# Altium schematic sheet BLETemp.SchDoc
size A4; PageSetup: Record=PageOptions|CenterHorizontal=True|CenterVertical=True|PrintScale=0.95|XCorrection=1.00|YCorrection=1.00|PrintKind=1|BorderSize=5000000|LeftOffset=0|BottomOffset=0|Orientation=2|PaperLength=1000|PaperWidth=1000|Scale=100|PaperSource=257|PrintQuality=600|MediaType=1|DitherType=10|PrintScaleMode=1|PaperKind=A4|PaperIndex=9
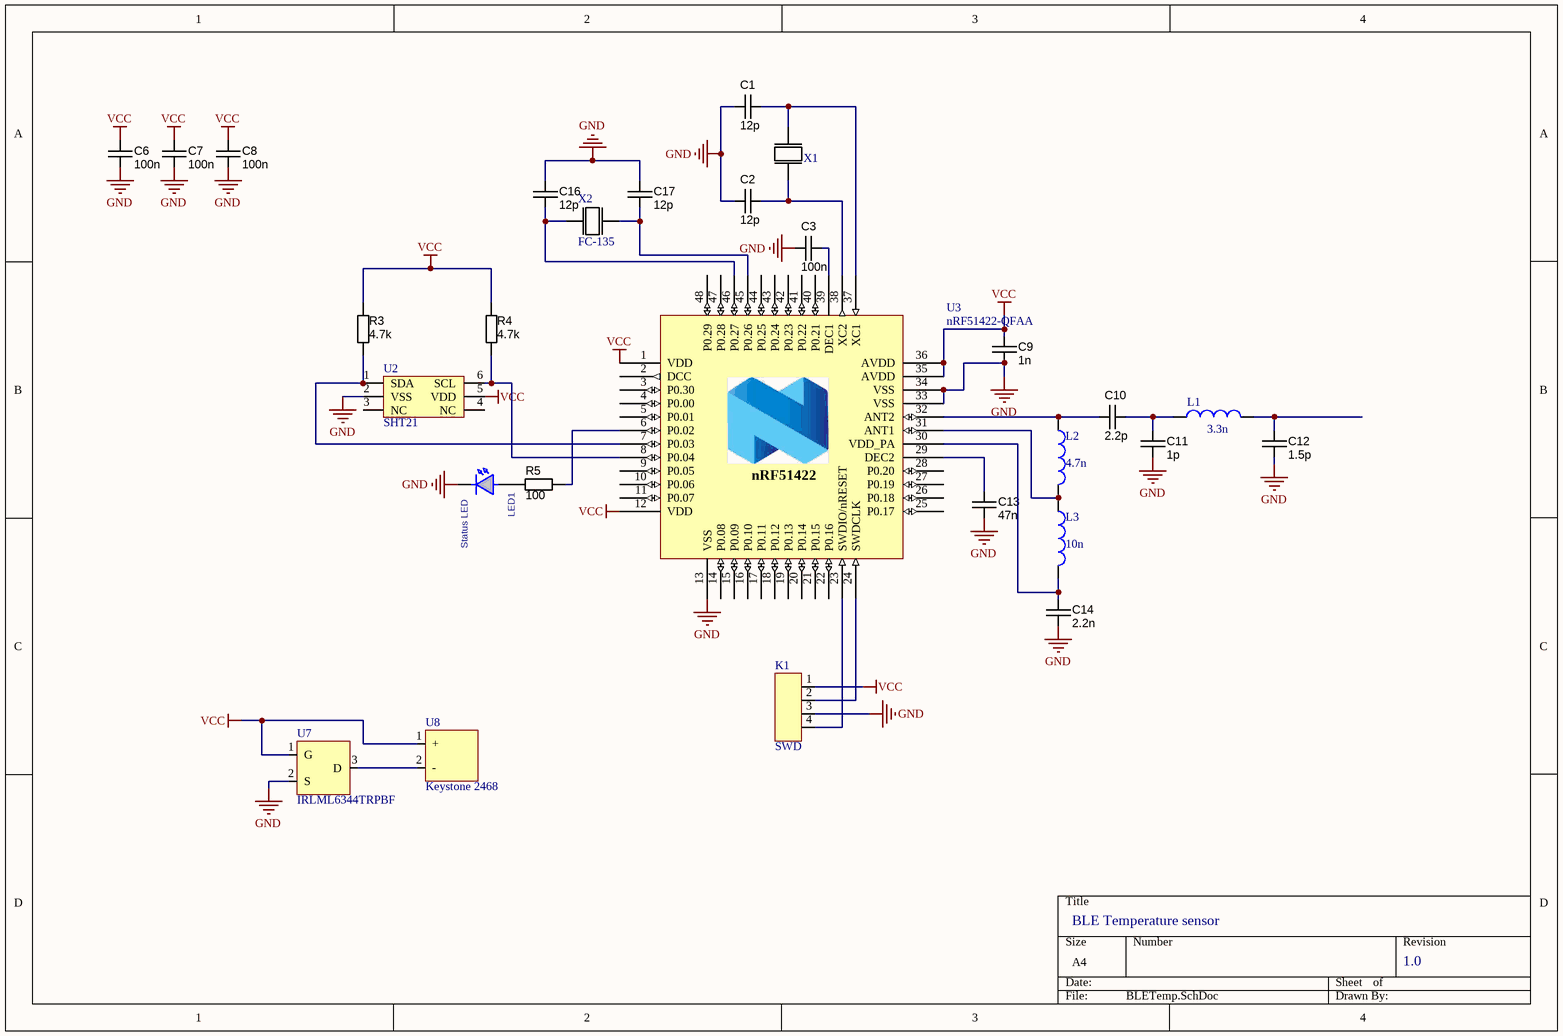
[diagram p0: BLETemp.SchDoc]

## Parts
C1  12p  [CAPC1005X55N]
C2  12p  [CAPC1005X55N]
C3  100n  [CAPC1005X55N]
C6  100n  [CAPC1005X55N]
C7  100n  [CAPC1005X55N]
C8  100n  [CAPC1005X55N]
C9  1n  [CAPC1005X55N]
C10  2.2p  [CAPC1005X55N]
C11  1p  [CAPC1005X55N]
C12  1.5p  [CAPC1005X55N]
C13  47n  [CAPC1005X55N]
C14  2.2n  [CAPC1005X55N]
C16  12p  [CAPC1005X55N]
C17  12p  [CAPC1005X55N]
K1  SWD  [H1x4]
L1  3.3n  [0402-A]
L2  4.7n  [0402-A]
L3  10n  [0402-A]
LED1  Status LED  [LED0805]
R3  4.7k  [RESC1005X40N]
R4  4.7k  [RESC1005X40N]
R5  100  [RESC1005X40N]
U2  SHT21  [DFN6]
U3  nRF51422-QFAA  [QFN40P600X600X90-48N]
U7  IRLML6344TRPBF  [SOT-23A-CB3_N]
U8  Keystone 2468  [AAA battery holder]
X1  16Mhz  [kvarc]  (value not drawn)
X2  FC-135  [FC-135 (3215)]

## Nets
GND: C1.2 C2.2 C3.1 C6.2 C7.2 C8.2 C9.2 C11.2 C12.2 C13.2 C14.2 C16.2 C17.2 K1.3 LED1.K U2.2(VSS) U3.13(VSS) U3.33(VSS) U3.34(VSS) U3.49 U7.2(S)
VCC: C6.1 C7.1 C8.1 C9.1 K1.1 R3.1 R4.1 U2.5(VDD) U3.1(VDD) U3.12(VDD) U3.35(AVDD) U3.36(AVDD) U7.1(G) U8.1(+)
NetC1_1: C1.1 U3.37(XC1) X1.1
NetC2_1: C2.1 U3.38(XC2) X1.3
NetC3_2: C3.2 U3.39(DEC1)
NetC10_1: C10.1 L2.1 U3.32(ANT2)
NetC10_2: C10.2 C11.1 L1.1
NetC12_1: C12.1 L1.2
NetC13_1: C13.1 U3.29(DEC2)
NetC14_1: C14.1 L3.2 U3.30(VDD_PA)
NetC16_1: C16.1 U3.46(P0.27) X2.1
NetC17_1: C17.1 U3.45(P0.26) X2.0
NetK1_2: K1.2 U3.24(SWDCLK)
NetK1_4: K1.4 U3.23(SWDIO/nRESET)
NetL2_2: L2.2 L3.1 U3.31(ANT1)
NetLED1_A: LED1.A R5.1
NetR3_2: R3.2 U2.1(SDA) U3.7(P0.03)
NetR4_2: R4.2 U2.6(SCL) U3.8(P0.04)
NetR5_2: R5.2 U3.6(P0.02)
NetU7_3: U7.3(D) U8.2(-)

Not connected (* = marked no-connect by the designer): U2 3(NC) 4(NC); U3 2(DCC) 3(P0.30) 4(P0.00) 5(P0.01) 9(P0.05) 10(P0.06) 11(P0.07) 14(P0.08) 15(P0.09) 16(P0.10) 17(P0.11) 18(P0.12) 19(P0.13) 20(P0.14) 21(P0.15) 22(P0.16) 25(P0.17) 26(P0.18) 27(P0.19) 28(P0.20) 40(P0.21) 41(P0.22) 42(P0.23) 43(P0.24) 44(P0.25) 47(P0.28) 48(P0.29)

## Notes on the sheet
- BLE Temperature sensor
- 1.0
- (in symbol nRF51422_QFAC) nRF51422

## Library data of the parts
C1 C2 C9-C12 C14 C16 C17 = CAPC_1n_0402_X7R_16V_10%: Capacitor SMD Cer 1nF 10% 16V X7R 0402; Manufacturer 1: AVX Corporation; Manufacturer Part Number 1: 0402YC102KAT2A; Ratings: 16V; X7R; SCDType: spec; Tolerance: ±10%; Operating Temperature: -55°C ~ 125°C; Package / Case: 0402 (1005 Metric); Size / Dimension: 0.039" L x 0.020" W (1.00mm x 0.50mm); Manufacturer 2: Yageo; Manufacturer Part Number 2: CC0402KRX7R7BB102; Supplier 1: Digi-Key; Supplier Part Number 1: 478-6197-1-ND; ComponentLink1URL: http://www.avx.com/docs/Catalogs/cx7r.pdf; ComponentLink1Description: http://www.avx.com/docs/Catalogs/cx7r.pdf; Supplier 2: Digi-Key; Supplier Part Number 2: 311-1352-1-ND; ComponentLink2URL: http://www.yageo.com/documents/recent/UPY-GPHC_X7R_6.3V-to-50V_8.pdf; ComponentLink2Description: http://www.yageo.com/documents/recent/UPY-GPHC_X7R_6.3V-to-50V_8.pdf
  C1 C2 C16 C17: Value: 12p
  C9: Value: 1n
  C10: Value: 2.2p
  C11: Value: 1p
  C12: Value: 1.5p
  C14: Value: 2.2n
C3 C6-C8 = CAPC_1n_0402_X7R_16V_10%: Capacitor SMD Cer 100nF 10% 10V X7R 0402; Manufacturer 1: AVX Corporation; Manufacturer Part Number 1: 0402YC102KAT2A; Ratings: 16V; X7R; SCDType: spec; Tolerance: ±10%; Operating Temperature: -55°C ~ 125°C; Package / Case: 0402 (1005 Metric); Size / Dimension: 0.039" L x 0.020" W (1.00mm x 0.50mm); Manufacturer 2: Yageo; Manufacturer Part Number 2: CC0402KRX7R7BB102; Supplier 1: Digi-Key; Supplier Part Number 1: 478-6197-1-ND; ComponentLink1URL: http://www.avx.com/docs/Catalogs/cx7r.pdf; ComponentLink1Description: http://www.avx.com/docs/Catalogs/cx7r.pdf; Supplier 2: Digi-Key; Supplier Part Number 2: 311-1352-1-ND; ComponentLink2URL: http://www.yageo.com/documents/recent/UPY-GPHC_X7R_6.3V-to-50V_8.pdf; ComponentLink2Description: http://www.yageo.com/documents/recent/UPY-GPHC_X7R_6.3V-to-50V_8.pdf; Value: 100n
C13 = CAPC_1n_0402_X7R_16V_10%: Capacitor SMD Cer 47nF 10% 10V X7R 0402; Manufacturer 1: AVX Corporation; Manufacturer Part Number 1: 0402YC102KAT2A; Ratings: 16V; X7R; SCDType: spec; Tolerance: ±10%; Operating Temperature: -55°C ~ 125°C; Package / Case: 0402 (1005 Metric); Size / Dimension: 0.039" L x 0.020" W (1.00mm x 0.50mm); Manufacturer 2: Yageo; Manufacturer Part Number 2: CC0402KRX7R7BB102; Supplier 1: Digi-Key; Supplier Part Number 1: 478-6197-1-ND; ComponentLink1URL: http://www.avx.com/docs/Catalogs/cx7r.pdf; ComponentLink1Description: http://www.avx.com/docs/Catalogs/cx7r.pdf; Supplier 2: Digi-Key; Supplier Part Number 2: 311-1352-1-ND; ComponentLink2URL: http://www.yageo.com/documents/recent/UPY-GPHC_X7R_6.3V-to-50V_8.pdf; ComponentLink2Description: http://www.yageo.com/documents/recent/UPY-GPHC_X7R_6.3V-to-50V_8.pdf; Value: 47n
K1 = H1x4: Header 1x4 (male)
L1-L3 = Inductor: Code_IEC: 1005; Published: 8-Jun-2000; LatestRevisionDate: 29-May-2009; LatestRevisionNote: IPC-7351 Footprint Added.; PackageReference: 0402-A; Publisher: Altium Limited; PackageDescription: Chip Inductor; Code_JEITA: 0402
  L1: Value: 3.3n
  L2: Value: 4.7n
  L3: Value: 10n
LED1 = LED: pin to pad: A>1 K>2; Value: {Value}
R3-R5 = RES_1K_0402_5%: Resistor SMD chip 1k Ohm 0.063W 5% 0402; Manufacturer 1: Yageo; Manufacturer Part Number 1: RC0402JR-071KL; Ratings: 1/16 W; SCDType: spec; Package / Case: 0402 (1005 Metric); Tolerance: ±5%; Supplier 1: Digi-Key; Supplier Part Number 1: 311-1.0KJRCT-ND; RoHS 1: RoHS Compliant; ComponentLink1URL: http://www.yageo.com/documents/recent/PYu-RC0402_51_RoHS_L_6.pdf; ComponentLink1Description: http://www.yageo.com/documents/recent/PYu-RC0402_51_RoHS_L_6.pdf; Supplier 2: Digi-Key; Supplier Part Number 2: 541-1.0KJCT-ND; Manufacturer 2: Vishay Dale; Manufacturer Part Number 2: CRCW04021K00JNED; RoHS 2: RoHS Compliant; ComponentLink2URL: http://www.vishay.com/doc?20035; ComponentLink2Description: http://www.vishay.com/doc?20035; Supplier 3: Digi-Key; Supplier Part Number 3: 1276-4376-1-ND; Manufacturer 3: Samsung Electro-Mechanics America, Inc; Manufacturer Part Number 3: RC1005J102CS; RoHS 3: RoHS Compliant; ComponentLink3URL: http://www.samsungsem.com/servlet/FileDownload?filename=productcatalog/pdf/Chip_Resistor.pdf; ComponentLink3Description: http://www.samsungsem.com/servlet/FileDownload?filename=productcatalog/pdf/Chip_Resistor.pdf; Supplier 4: Digi-Key; Supplier Part Number 4: RHM1.0KCECT-ND; Manufacturer 4: Rohm Semiconductor; Manufacturer Part Number 4: MCR01MRTJ102; RoHS 4: RoHS Compliant; ComponentLink4URL: http://rohmfs.rohm.com/en/products/databook/datasheet/passive/resistor/chip_resistor/mcr_g.pdf; ComponentLink4Description: http://rohmfs.rohm.com/en/products/databook/datasheet/passive/resistor/chip_resistor/mcr_g.pdf; Supplier 5: Digi-Key; Supplier Part Number 5: P1.0KJCT-ND; Manufacturer 5: Panasonic Electronic Components; Manufacturer Part Number 5: ERJ-2GEJ102X; RoHS 5: RoHS Compliant; ComponentLink5URL: http://industrial.panasonic.com/www-cgi/jvcr13pz.cgi?E+PZ+3+AOA0001+ERJ2GEJ102X+7+WW; ComponentLink5Description: http://industrial.panasonic.com/www-cgi/jvcr13pz.cgi?E+PZ+3+AOA0001+ERJ2GEJ102X+7+WW
  R3 R4: Value: 4.7k
  R5: Value: 100
U2 = SHT25: SHT21 temp. and hum. sensor
U3 = nRF51422_QFAC: Multi-protocol Bluetooth Low Energy, ANT and 2.4GHz proprietary system-on-chip; Part Number: nRF51422-QFAC-XLR3+; Manufacturer: Nordic Semiconductor; Manufacturer Part Number: nRF51422-QFACAx; Note: nRF51422 - QFN48 6x6 0.4mm pitch; Artikkelnr Noca: 15079264; Artikkelnr Simpro: N.A.; Datasheet: *; LatestRevisionDate: 2014-09-17; Pin Count: 48; Publisher: Nordic Semiconductor; Published: 2014-06-04; Value: nRF51422-QFAA; Supplier: Nordic Semiconductor; Supplier part number: *; 2nd source Supplier: *; 2nd source part number: *; Footprint Doc: QFN-48
U8 = Keystone 2468: AAA battery holder
X1 = 7M-16.000MEEQ-T: 16Mhz smd quartz
X2 = FC-135: 32.768KHZ crystal